# Altium schematic sheet Carte_TryOhm.SchDoc
size A4; Author: Audran; CompanyName: Goldorak; Address1: Electrolab; Address2: 52 rue Paul Lescop; Address3: 92000 Nanterre; DocumentNumber: 1; SheetNumber: 1; SheetTotal: 5; ProjectName: Cartes_2017
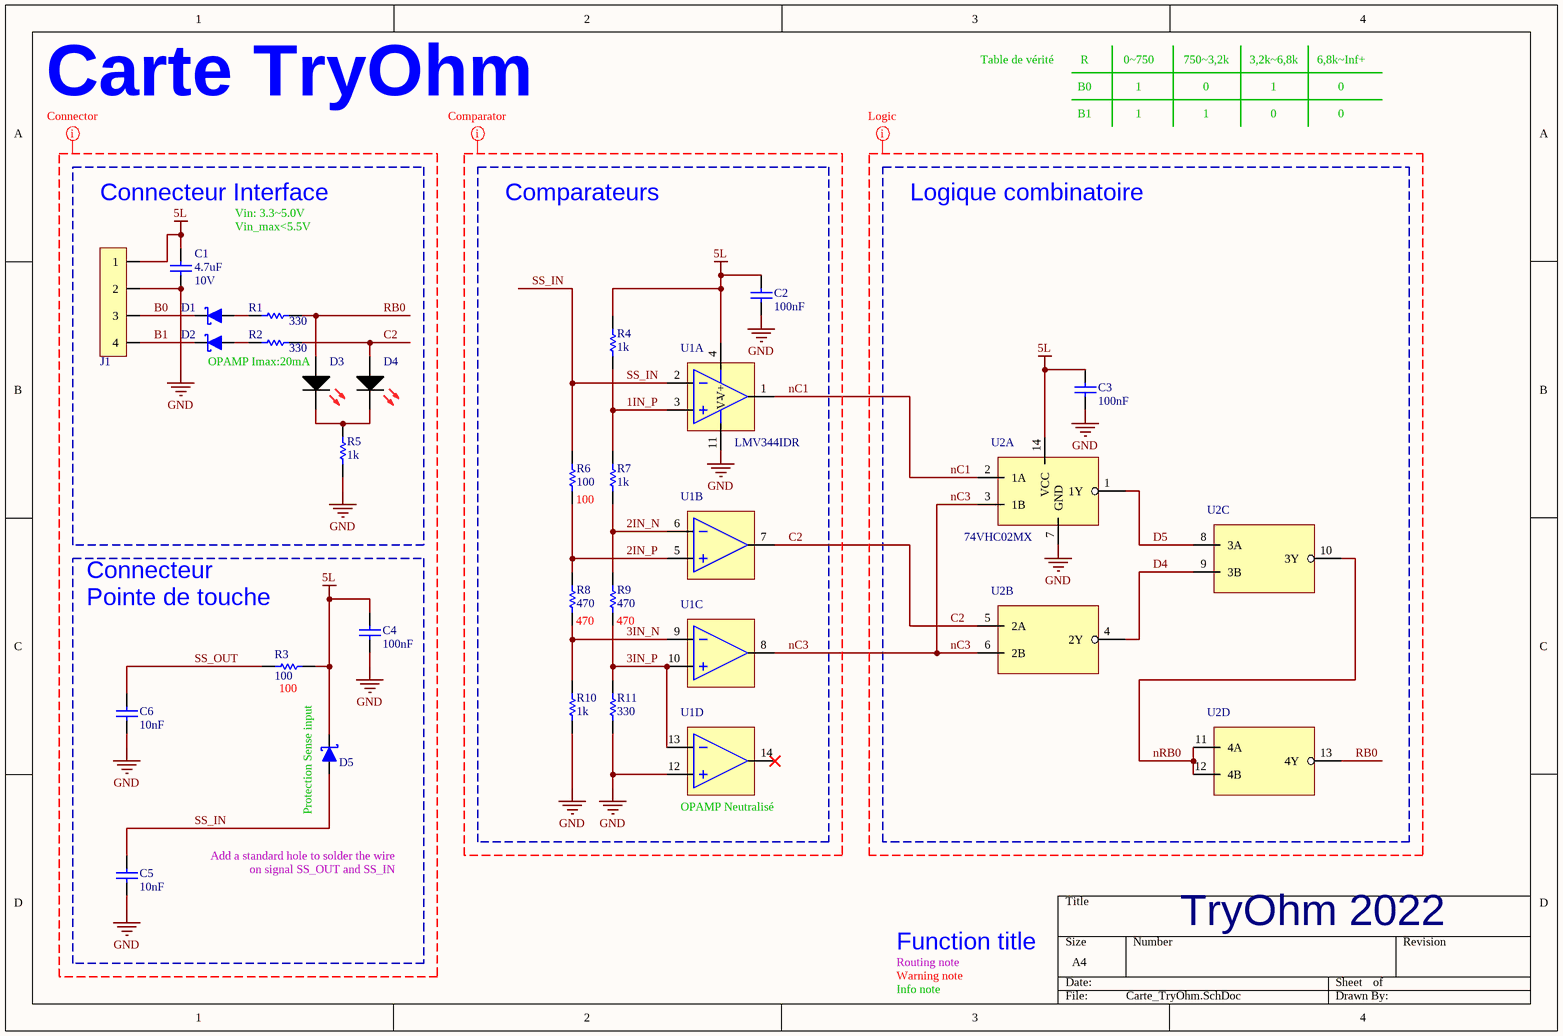
[diagram p0: Carte_TryOhm.SchDoc]

## Parts
C1  4.7uF  RatedVoltage: 10V  [WCAP-CSGP_0603, 1.6x0.8x0.8]
C2  100nF  [WCAP-CSGP_0603, 1.6x0.8x0.8]
C3  100nF  [WCAP-CSGP_0603, 1.6x0.8x0.8]
C4  100nF  [WCAP-CSGP_0603, 1.6x0.8x0.8]
C5  10nF  [WCAP-CSGP_0603, 1.6x0.8x0.8]
C6  10nF  [WCAP-CSGP_0603, 1.6x0.8x0.8]
D1  RBR3MM40ATFTR  [SOD-123FL]  (value not drawn)
D2  RBR3MM40ATFTR  [SOD-123FL]  (value not drawn)
D3  150060RS75000  [SMCW_0603]  (value not drawn)
D4  150060RS75000  [SMCW_0603]  (value not drawn)
D5  RBR3MM40ATFTR  [SOD-123FL]  (value not drawn)
J1  22-03-2041  [22-03-2041]  (value not drawn)
R1  value 330  [RESC1608X06N]  (hidden comment: RC0603FR-07330RL)
R2  value 330  [RESC1608X06N]  (hidden comment: RC0603FR-07330RL)
R3  value 100  [RESC1608X06N]  (hidden comment: RC0603FR-07100RL)
R4  value 1k  [RESC1608X06N]  (hidden comment: RC0603FR-071KL)
R5  value 1k  [RESC1608X06N]  (hidden comment: RC0603FR-071KL)
R6  value 100  [RESC1608X06N]  (hidden comment: RC0603FR-07100RL)
R7  value 1k  [RESC1608X06N]  (hidden comment: RC0603FR-071KL)
R8  value 470  [RESC1608X06N]  (hidden comment: RC0603FR-07470RL)
R9  value 470  [RESC1608X06N]  (hidden comment: RC0603FR-07470RL)
R10  value 1k  [RESC1608X06N]  (hidden comment: RC0603FR-071KL)
R11  value 330  [RESC1608X06N]  (hidden comment: RC0603FR-07330RL)
U1  LMV344IDR  [SOIC127P600X175-14N]  (parts A,B,C,D of 4)
U2  74VHC02MX  [SOIC127P600X175-14N]  (parts A,B,C,D of 4)

## Blocks framed on the sheet
Connecteur Interface: C1 D1-D4 J1 R1 R2 R5
Comparateurs: C2 R4 R6-R11 U1
Logique combinatoire: C3 U2

## Nets
5L: C1.1 C2.1 C3.1 C4.1 D5.2 J1.1 R3.1 R4.1 U1.4(V+) U2.14(VCC)
GND: C1.2 C2.2 C3.2 C4.2 C5.1 C6.1 J1.2 R5.1 R10.2 R11.2 U1.11(V-) U1.12(4IN+) U2.7(GND)
1IN_P: R4.2 R7.1 U1.3(1IN+)
2IN_N: R7.2 R9.1 U1.6(2IN-)
2IN_P: R6.2 R8.1 U1.5(2IN+)
3IN_N: R8.2 R10.1 U1.9(3IN-)
3IN_P: R9.2 R11.1 U1.10(3IN+) U1.13(4IN-)
B0: D1.2 J1.3
B1: D2.2 J1.4
C2: D4.2(A) R2.1 U1.7(2OUT) U2.5(2A)
D4: U2.4(2Y) U2.9(3B)
D5: U2.1(1Y) U2.8(3A)
nC1: U1.1(1OUT) U2.2(1A)
nC3: U1.8(3OUT) U2.3(1B) U2.6(2B)
nRB0: U2.10(3Y) U2.11(4A) U2.12(4B)
RB0: D3.2(A) R1.1 U2.13(4Y)
SS_IN: C5.2 D5.1 R6.1 U1.2(1IN-)
SS_OUT: C6.2 R3.2
NetD1_1: D1.1 R1.2
NetD2_1: D2.1 R2.2
NetD3_1: D3.1(C) D4.1(C) R5.2

Not connected (* = marked no-connect by the designer): U1 14(4OUT)*

## Layout directives
net class Connector: 5L, B0, B1, C2, GND, RB0, SS_IN, SS_OUT
net class Comparator: 1IN_P, 2IN_N, 2IN_P, 3IN_N, 3IN_P, 5L, C2, GND, nC1, nC3, SS_IN
net class Logic: 5L, C2, D4, D5, GND, nC1, nC3, nRB0, RB0

## Notes on the sheet
- Carte TryOhm
- Table de vérité
- B0
- B1
- R
- 1
- 0~750
- 0
- 750~3,2k
- 3,2k~6,8k
- 6,8k~Inf+
- Vin: 3.3~5.0V
- Vin_max<5.5V
- OPAMP Imax:20mA
- (near R6) 100
- Connecteur
- Pointe de touche
- (near R8) 470
- (near R9) 470
- (near R3) 100
- Protection Sense input
- (near C5) Add a standard hole to solder the wire
- (near U1) OPAMP Neutralisé
- on signal SS_OUT and SS_IN
- Routing note
- Warning note
- Function title
- TryOhm 2022
- Info note

## Library data of the parts
C1 = WCAP-CSGP, 885012106012: CAP CER 4.7UF 10V X5R 0603; Manufacturer: Wurth Elektronik; ComponentLink1Description: Datasheet; ComponentLink1URL: http://katalog.we-online.com/pbs/datasheet/885012106012.pdf; Manufacturer Part Number: 885012106012; Value: 4.7uF; Size: 0603; CeramicType: X5R; Supplier 2: JLCPCB; Supplier Part Number 2: C19666; Supplier Footprint 2: 0603; Supplier 1: Farnell; Supplier Part Number 1: 2495148
C2-C4 = WCAP-CSGP, 885012206095: CAP CER 100nF 50V X7R 0603; Manufacturer: Wurth Elektronik; ComponentLink1Description: Datasheet; ComponentLink1URL: http://katalog.we-online.com/pbs/datasheet/885012206095.pdf; Manufacturer Part Number: 885012206095; Value: 100nF; Size: 0603; CeramicType: X7R; Supplier 2: JLCPCB; Supplier Part Number 2: C14663; RatedVoltage: 50V; Supplier Footprint 2: 0603; Supplier 1: Farnell; Supplier Part Number 1: 2495187
C5 C6 = WCAP-CSGP, 885012206089: CAP CER 10nF 50V X7R 0603; Manufacturer: Wurth Elektronik; ComponentLink1Description: Datasheet; ComponentLink1URL: http://katalog.we-online.com/pbs/datasheet/885012206089.pdf; Manufacturer Part Number: 885012206089; Value: 10nF; Size: 0603; CeramicType: X7R; RatedVoltage: 50V; Supplier 2: JLCPCB; Supplier Part Number 2: C57112; Supplier Footprint 2: 0603; Supplier 1: Farnell; Supplier Part Number 1: 2495182
D1 D2 D5 = RBR3MM40ATFTR: DIODE SCHOTTKY 40V 3A SOD123-FL; Manufacturer: ROHM; Supplier 1: Farnell; Manufacturer Part Number: RBR3MM40ATFTR; ComponentLink1URL: http://www.farnell.com/datasheets/2067190.pdf; ComponentLink1Description: Datasheet; Supplier Part Number 1: 2581593; ComponentLink2Description: Manufacturer; ComponentLink2URL: http://www.rohm.com/web/global/products/-/product/RBR3MM40ATF; ContinuousForwardCurrent: 3A; Type: Schottky; Supplier 2: JLCPCB; Supplier Part Number 2: C8598; Value: 40V; Supplier Footprint 2: SOD-123
D3 D4 = WL-SMCW 0603  150060RS75000: SMD mono-color Chip LED, WL-SMCW, Red; Manufacturer: Wurth Elektronik; Value: Rouge; Manufacturer Part Number: 150060RS75000; ComponentLink1Description: Datasheet; ComponentLink1URL: http://katalog.we-online.com/led/datasheet/150060RS75000.pdf; Supplier 1: Farnell; Supplier Part Number 1: 2322071; Supplier 2: JLCPCB; Supplier Part Number 2: C72044; Supplier Footprint 2: LED_0603
J1 = 22-03-2041: CONN HEADER VERT 4POS 2.54MM; Manufacturer: MOLEX; Supplier 1: Farnell; Supplier Part Number 1: 9731091; Manufacturer Part Number: 22-03-2041; ComponentLink1URL: https://www.molex.com/pdm_docs/sd/022032041_sd.pdf; ComponentLink1Description: Datasheet
R1-R3 R6 R8 R9 R11 = RC0603FR-07330RL: RES SMD 330 OHM 1% 1/10W 0603; Manufacturer: Yageo; Power: 100mW; Vmax: 50V; Type: Thick Film; ComponentLink1Description: Manufacturer; ComponentLink1URL: http://www.yageo.com/NewPortal/_en/index.jsp; ComponentLink2Description: Datasheet; ComponentLink2URL: http://www.farnell.com/datasheets/2167052.pdf; Supplier 1: Farnell; Supplier Part Number 1: 9238425; Precision: ±1%; Supplier 2: JLCPCB; Supplier Footprint 2: 0603
  R1 R2 R11: Manufacturer Part Number: RC0603FR-07330RL; Supplier Part Number 2: C23138
  R3 R6: Manufacturer Part Number: RC0603FR-07100RL; Supplier Part Number 2: C22775
  R8 R9: Manufacturer Part Number: RC0603FR-07470RL; Supplier Part Number 2: C23179
R4 R5 R7 R10 = RC0603FR-071KL: RES SMD 1K OHM 1% 1/10W 0603; Manufacturer: Yageo; Power: 100mW; Vmax: 50V; Manufacturer Part Number: RC0603FR-071KL; Type: Thick Film; ComponentLink1Description: Manufacturer; ComponentLink1URL: http://www.yageo.com/NewPortal/_en/index.jsp; ComponentLink2Description: Datasheet; ComponentLink2URL: http://www.farnell.com/datasheets/2167052.pdf; Precision: ±1%; Supplier 1: Farnell; Supplier Part Number 1: 9238484; Supplier 2: JLCPCB; Supplier Part Number 2: C21190; Supplier Footprint 2: 0603
U1 = LMV344IDR: IC OPAMP GP 4 CIRCUIT 14SOIC; Manufacturer: TEXAS INSTRUMENTS; ComponentLink1URL: https://www.ti.com/lit/ds/symlink/lmv341.pdf; ComponentLink1Description: Datasheet; Manufacturer Part Number: LMV344IDR; Supplier 1: Farnell; Supplier Part Number 1: 3117230; Supplier 2: JLCPCB; Supplier Part Number 2: C181501
U2 = 74VHC02MX: IC GATE NOR 4CH 2-INP 14SOIC; Manufacturer: ONSEMI; ComponentLink1URL: https://www.onsemi.com/pdf/datasheet/74vhc02-d.pdf; ComponentLink1Description: Datasheet; Manufacturer Part Number: 74VHC02MX; Supplier 1: Farnell; Supplier Part Number 1: 2453074; Supplier 2: JLCPCB; Supplier Part Number 2: C238963